# EAGLE design Schematic_DSP_2.0 (EAGLE 7.6.0)

## Sheet 1 of 2: Power
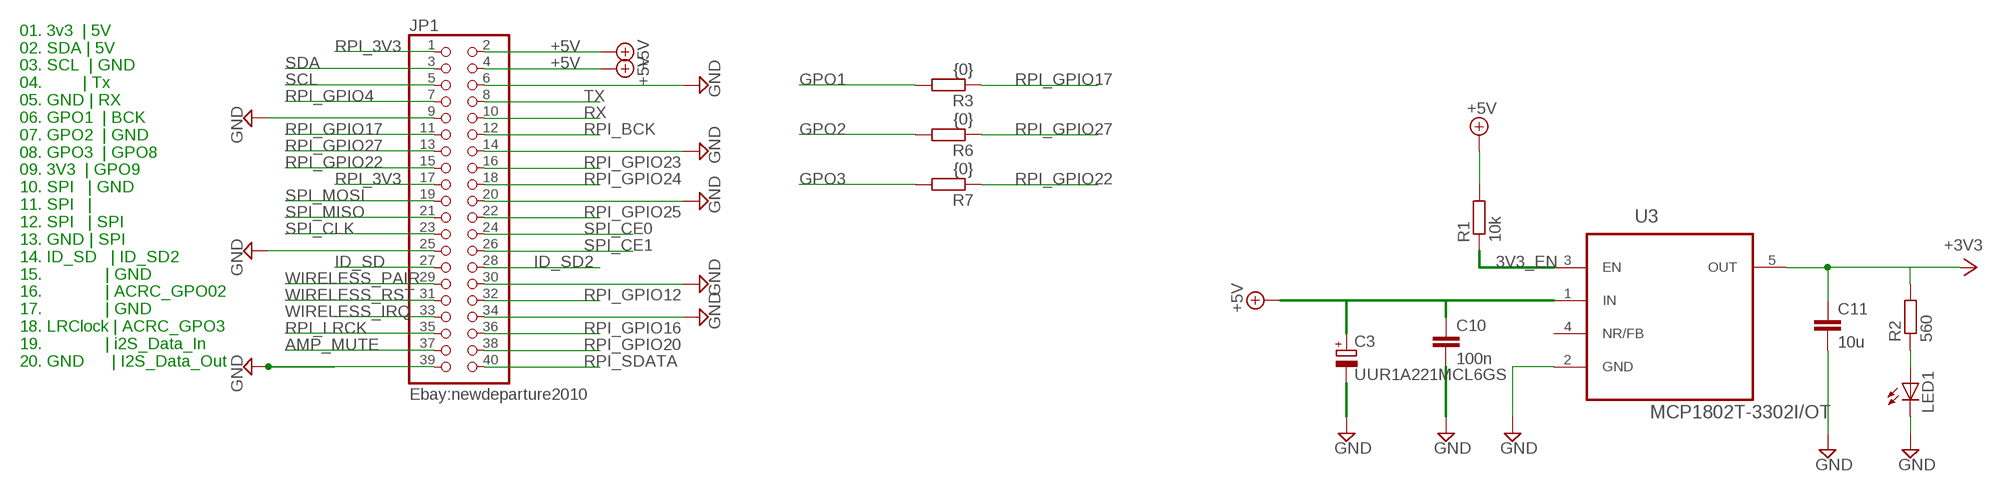
[diagram p0: schematic, sheet 1]

### Parts
C3  UUR1A221MCL6GS  CPOL-EUUD-6,3X7,7  [UD-6,3X7,7_NICHICON]
C10  100n  C-EUC0603  [C0603]
C11  10u  C-EUC0805  [C0805]
JP1  Ebay:newdeparture2010  PINHD-2X20  [2X20]
LED1  LEDSML0603  [SML0603]
R1  10k  R-EU_R0603  [R0603]
R2  560  R-EU_R0603  [R0603]
R3  {0}  R-EU_R0603  [R0603]
R6  {0}  R-EU_R0603  [R0603]
R7  {0}  R-EU_R0603  [R0603]
U3  MCP1802T-3302I/OT  TPS73633DBVT  [SOT95P280X145-5N]

### Nets
3V3_EN: R1.1 U3.3(EN)
+3V3 [+3V3]: C11.1 R2.2 U3.5(OUT) ; also sheet 2
+5V [+3V3]: C3.+ C10.1 JP1.2 JP1.4 R1.2 U3.1(IN) ; also sheet 2
AMP_MUTE: JP1.37 ; also sheet 2
GND [GND]: C3.- C10.2 C11.2 JP1.6 JP1.9 JP1.14 JP1.20 JP1.25 JP1.30 JP1.34 JP1.39 LED1.C U3.2(GND) ; also sheet 2
GPO1: R3.2 ; also sheet 2
GPO2: R6.2 ; also sheet 2
GPO3: R7.2 ; also sheet 2
ID_SD: JP1.27
ID_SD2: JP1.28
N$4: LED1.A R2.1
RPI_3V3: JP1.1 JP1.17
RPI_BCK: JP1.12 ; also sheet 2
RPI_GPIO4: JP1.7
RPI_GPIO12: JP1.32
RPI_GPIO16: JP1.36
RPI_GPIO17: JP1.11 R3.1
RPI_GPIO20: JP1.38
RPI_GPIO22: JP1.15 R7.1
RPI_GPIO23: JP1.16
RPI_GPIO24: JP1.18
RPI_GPIO25: JP1.22
RPI_GPIO27: JP1.13 R6.1
RPI_LRCK: JP1.35 ; also sheet 2
RPI_SDATA: JP1.40 ; also sheet 2
RX: JP1.10
SCL: JP1.5 ; also sheet 2
SDA: JP1.3 ; also sheet 2
SPI_CE0: JP1.24
SPI_CE1: JP1.26
SPI_CLK: JP1.23
SPI_MISO: JP1.21
SPI_MOSI: JP1.19
TX: JP1.8
WIRELESS_IRQ: JP1.33
WIRELESS_PAIR: JP1.29
WIRELESS_RST: JP1.31
Unconnected: U3.4(NR/FB)

### Notes on the sheet
- 01. 3v3  | 5V
  02. SDA | 5V
  03. SCL  | GND
  04.         | Tx
  05. GND | RX
  06. GPO1  | BCK
  07. GPO2  | GND
  08. GPO3  | GPO8
  09. 3V3  | GPO9
  10. SPI   | GND
  11. SPI   |
  12. SPI   | SPI
  13. GND | SPI
  14. ID_SD   | ID_SD2
  15.              | GND
  16.              | ACRC_GPO02
  17.              | GND
  18. LRClock | ACRC_GPO3
  19.              | i2S_Data_In
  20. GND      | I2S_Data_Out

## Sheet 2 of 2: Core
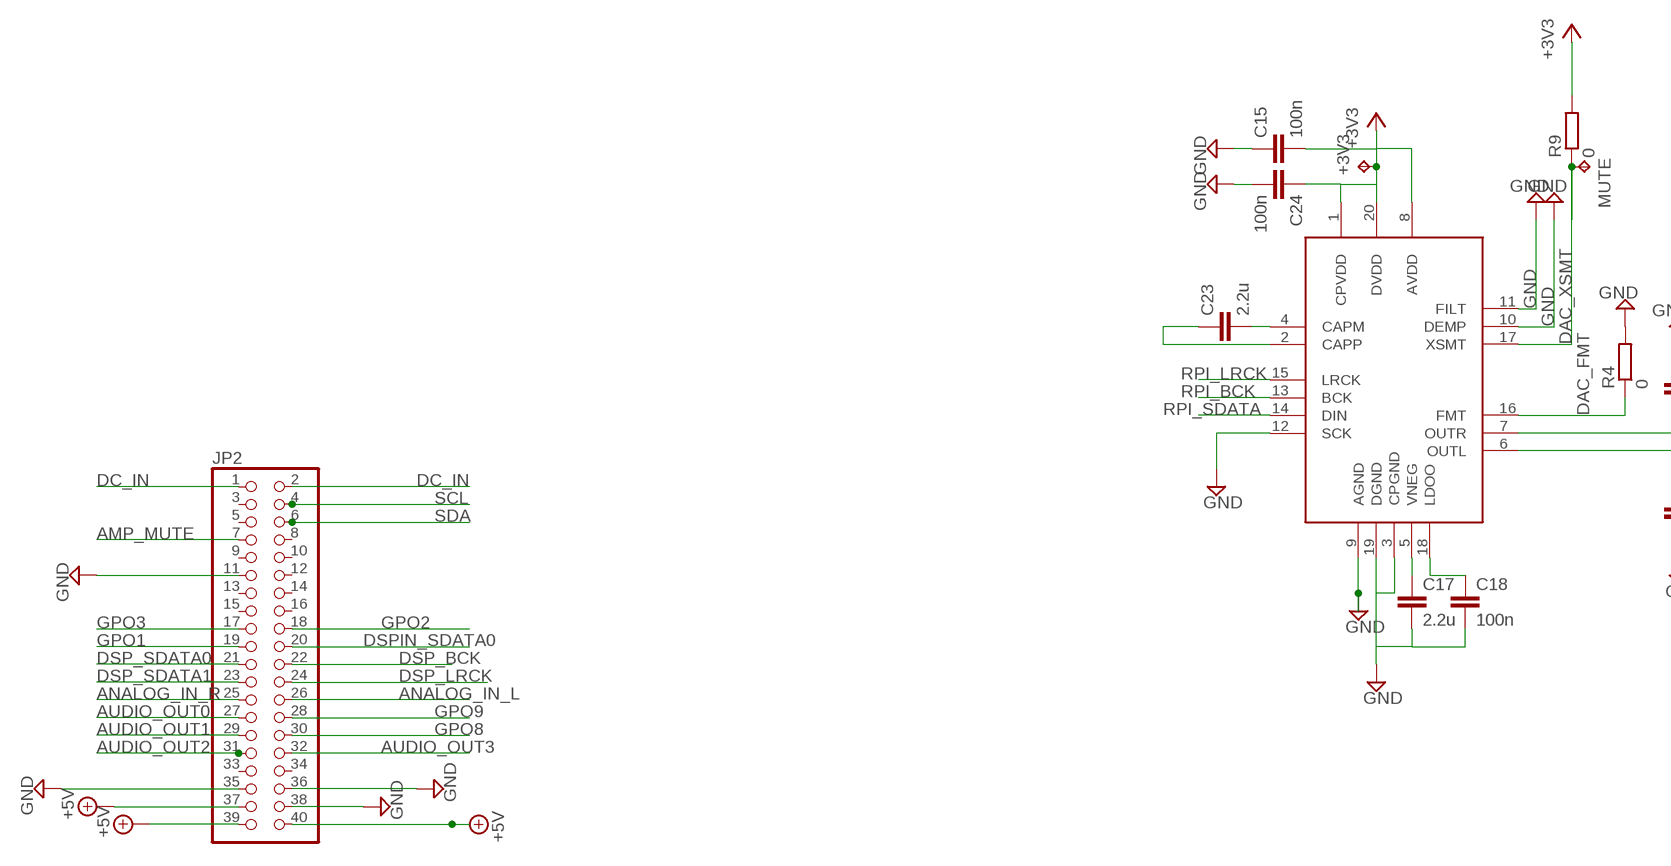
[diagram p1: schematic, sheet 2, part 1 of 2]
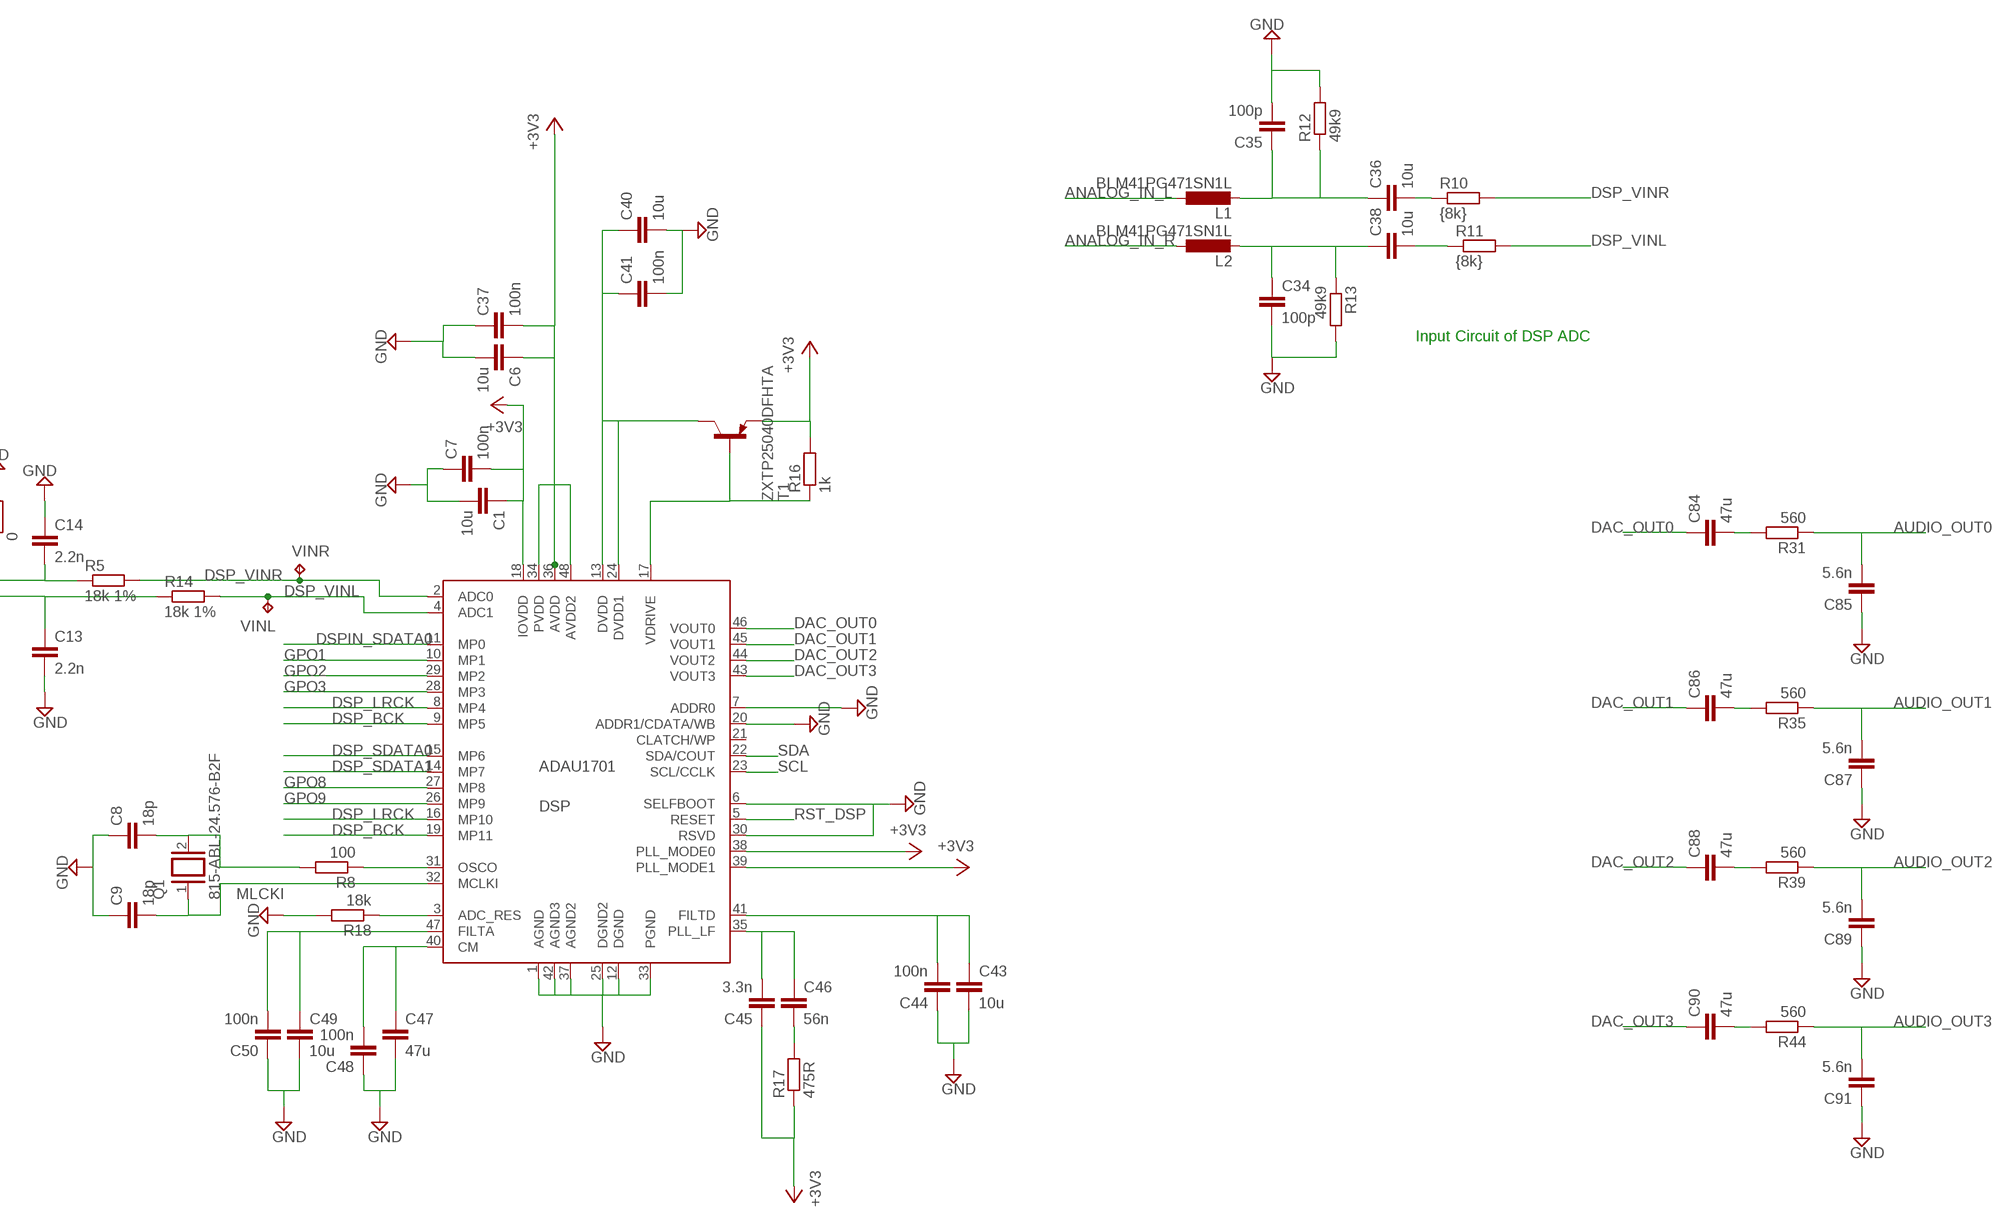
[diagram p2: schematic, sheet 2, part 2 of 2]

### Parts
+3V3  TPTP10R  [TP10R]
C1  10u  C-EUC0805  [C0805]
C6  10u  C-EUC0805  [C0805]
C7  100n  C-EUC0603  [C0603]
C8  18p  C-EUC0603  [C0603]
C9  18p  C-EUC0603  [C0603]
C13  2.2n  C-EUC0603  [C0603]
C14  2.2n  C-EUC0603  [C0603]
C15  100n  C-EUC0603  [C0603]
C17  2.2u  C-EUC0603  [C0603]
C18  100n  C-EUC0603  [C0603]
C23  2.2u  C-EUC0603  [C0603]
C24  100n  C-EUC0603  [C0603]
C34  100p  C-EUC0603  [C0603]
C35  100p  C-EUC0603  [C0603]
C36  10u  C-EUC0805  [C0805]
C37  100n  C-EUC0603  [C0603]
C38  10u  C-EUC0805  [C0805]
C40  10u  C-EUC0805  [C0805]
C41  100n  C-EUC0603  [C0603]
C43  10u  C-EUC0805  [C0805]
C44  100n  C-EUC0603  [C0603]
C45  3.3n  C-EUC0603  [C0603]
C46  56n  C-EUC0603  [C0603]
C47  47u  C-EUC0805  [C0805]
C48  100n  C-EUC0603  [C0603]
C49  10u  C-EUC0805  [C0805]
C50  100n  C-EUC0603  [C0603]
C84  47u  C-EUC0805  [C0805]
C85  5.6n  C-EUC0603  [C0603]
C86  47u  C-EUC0805  [C0805]
C87  5.6n  C-EUC0603  [C0603]
C88  47u  C-EUC0805  [C0805]
C89  5.6n  C-EUC0603  [C0603]
C90  47u  C-EUC0805  [C0805]
C91  5.6n  C-EUC0603  [C0603]
DAC1  PCM5102A  [20L-TSSOP]
DSP  ADAU1701  [PQFP48]
JP2  PINHD-2X20  [2X20]
L1  BLM41PG471SN1L  L-EUL4532C  [L4532M]
L2  BLM41PG471SN1L  L-EUL4532C  [L4532M]
MUTE  TPTP10R  [TP10R]
Q1  815-ABL-24.576-B2F  XTAL/S  [QS]
R4  0  R-EU_R0603  [R0603]
R5  18k 1%  R-EU_R0603  [R0603]
R8  100  R-EU_R0603  [R0603]
R9  0  R-EU_R0603  [R0603]
R10  {8k}  R-EU_R0603  [R0603]
R11  {8k}  R-EU_R0603  [R0603]
R12  49k9  R-EU_R0603  [R0603]
R13  49k9  R-EU_R0603  [R0603]
R14  18k 1%  R-EU_R0603  [R0603]
R16  1k  R-EU_R0603  [R0603]
R17  475R  R-EU_R0603  [R0603]
R18  18k  R-EU_R0603  [R0603]
R31  560  R-EU_R0603  [R0603]
R35  560  R-EU_R0603  [R0603]
R39  560  R-EU_R0603  [R0603]
R44  560  R-EU_R0603  [R0603]
T1  ZXTP25040DFHTA  BC857A-PNP-SOT23-BEC  [SOT23-BEC]
VINL  TPTP14R  [TP14R]
VINR  TPTP14R  [TP14R]

### Nets
+3V3 [+3V3]: +3V3.TP C1.1 C6.1 C7.2 C15.2 C24.1 C37.2 C45.1 DAC1.1(CPVDD) DAC1.8(AVDD) DAC1.20(DVDD) DSP.18(IOVDD) DSP.34(PVDD) DSP.36(AVDD) DSP.38(PLL_MODE0) DSP.39(PLL_MODE1) DSP.48(AVDD2) R9.2 R16.2 R17.1 T1.E ; also sheet 1
+5V [+3V3]: JP2.37 JP2.39 JP2.40 ; also sheet 1
AMP_MUTE: JP2.7 ; also sheet 1
ANALOG_IN_L: JP2.26 L1.1
ANALOG_IN_R: JP2.25 L2.1
AUDIO_OUT0: C85.2 JP2.27 R31.1
AUDIO_OUT1: C87.2 JP2.29 R35.1
AUDIO_OUT2: C89.2 JP2.31 R39.1
AUDIO_OUT3: C91.2 JP2.32 R44.1
CM: C47.1 C48.2 DSP.40(CM)
DAC_FMT: DAC1.16(FMT) R4.1
DAC_OUT0: C84.1 DSP.46(VOUT0)
DAC_OUT1: C86.1 DSP.45(VOUT1)
DAC_OUT2: C88.1 DSP.44(VOUT2)
DAC_OUT3: C90.1 DSP.43(VOUT3)
DAC_OUTL: C13.1 DAC1.6(OUTL) R14.1
DAC_OUTR: C14.2 DAC1.7(OUTR) R5.1
DAC_XSMT: DAC1.17(XSMT) MUTE.TP R9.1
DC_IN: JP2.1 JP2.2
DSP_BCK [Clock]: DSP.9(MP5) DSP.19(MP11) JP2.22
DSP_LRCK [Clock]: DSP.8(MP4) DSP.16(MP10) JP2.24
DSP_SDATA0 [Clock]: DSP.15(MP6) JP2.21
DSP_SDATA1 [Clock]: DSP.14(MP7) JP2.23
DSP_VINL: DSP.4(ADC1) R11.2 R14.2 VINL.TP
DSP_VINR: DSP.2(ADC0) R5.2 R10.2 VINR.TP
DSPIN_SDATA0: DSP.11(MP0) JP2.20
FILTA: C49.1 C50.2 DSP.47(FILTA)
FILTD [Clock]: C43.1 C44.2 DSP.41(FILTD)
GND [GND]: C1.2 C6.2 C7.1 C8.1 C9.1 C13.2 C14.1 C15.1 C17.2 C18.2 C24.2 C34.2 C35.2 C37.1 C40.2 C41.2 C43.2 C44.1 C47.2 C48.1 C49.2 C50.1 C85.1 C87.1 C89.1 C91.1 DAC1.3(CPGND) DAC1.9(AGND) DAC1.10(DEMP) DAC1.11(FILT) DAC1.12(SCK) DAC1.19(DGND) DSP.1(AGND) DSP.6(SELFBOOT) DSP.7(ADDR0) DSP.12(DGND) DSP.20(ADDR1/CDATA/WB) DSP.25(DGND2) DSP.30(RSVD) DSP.33(PGND) DSP.37(AGND2) DSP.42(AGND3) JP2.11 JP2.35 JP2.36 JP2.38 R4.2 R12.2 R13.2 R18.2 ; also sheet 1
GPO1: DSP.10(MP1) JP2.19 ; also sheet 1
GPO2: DSP.29(MP2) ; also sheet 1
GPO3: DSP.28(MP3) ; also sheet 1
GPO8: DSP.27(MP8) JP2.30
GPO9: DSP.26(MP9) JP2.28
MLCKI [Clock]: C9.2 DSP.32(MCLKI) Q1.1
N$5: C40.1 C41.1 DSP.13(DVDD) DSP.24(DVDD1) T1.C
N$7 [Clock]: DSP.31(OSCO) R8.1
N$8: DSP.17(VDRIVE) R16.1 T1.B
N$13 [Clock]: C8.2 Q1.2 R8.2
N$18: C46.2 R17.2
N$23: C17.1 DAC1.5(VNEG)
N$24: C23.2 DAC1.4(CAPM)
N$27: DSP.3(ADC_RES) R18.1
N$32: C36.2 R10.1
N$38: C18.1 DAC1.18(LDOO)
N$40: C38.2 R11.1
N$41: C23.1 DAC1.2(CAPP)
N$44: C34.1 C38.1 L2.2 R13.1
N$45: C35.1 C36.1 L1.2 R12.1
N$75: C84.2 R31.2
N$76: C86.2 R35.2
N$77: C88.2 R39.2
N$78: C90.2 R44.2
PLL_LF [Clock]: C45.2 C46.1 DSP.35(PLL_LF)
RPI_BCK: DAC1.13(BCK) ; also sheet 1
RPI_LRCK: DAC1.15(LRCK) ; also sheet 1
RPI_SDATA: DAC1.14(DIN) ; also sheet 1
RST_DSP: DSP.5(RESET)
SCL: DSP.23(SCL/CCLK) JP2.4 ; also sheet 1
SDA: DSP.22(SDA/COUT) JP2.6 ; also sheet 1
Unconnected: DSP.21(CLATCH/WP) JP2.3 JP2.5 JP2.8 JP2.9 JP2.10 JP2.12 JP2.13 JP2.14 JP2.15 JP2.16 JP2.17 JP2.18 JP2.33 JP2.34

### Notes on the sheet
- Input Circuit of DSP ADC

## Library data of the parts
+3V3 MUTE VINL VINR = testpad:TP: Test pad
C1 C6-C11 C13-C15 C17 C18 C23 C24 C34-C38 C40 C41 C43-C50 C84-C91 = rcl:C-EU: CAPACITOR, European symbol
C3 = rcl:CPOL-EU: POLARIZED CAPACITOR, European symbol
DAC1 = Texas Instruments_By_element14_Batch_1:PCM5102A: 2VRMS DirectPath™, 112/106/100dB Audio Stereo DAC with 32-bit, 384kHz PCM Interface
DSP = analog-devices:ADAU1701
JP1 JP2 = pinhead:PINHD-2X20: PIN HEADER
L1 L2 = rcl:L-EU: INDUCTOR, European symbol
LED1 = led:LED: LED OSRAM: - CHIPLED LG R971, LG N971, LY N971, LG Q971, LY Q971, LO R971, LY R971 LH N974, LH R974 LS Q976, LO Q976, LY Q976 LO Q996 - Hyper CHIPLED LW Q18S LB Q993, LB Q99A, LB R99A - SideLED LS A670, LO A670, LY A670, LG A670, LP A670 LB A673, LV A673, LT A673, LW A673 LH A674 LY A675 LS A676, LA A676, LO A676, LY A676, LW A676 LS A679, LY A679, LG A679 - Hyper Micro SIDELED® LS Y876, LA Y876, LO Y876, LY Y876 LT Y87S - SmartLED LW L88C, LW L88S LB L89C, LB L89S, LG L890 LS L89K, LO L89K, LY L89K LS L896, LA L896, LO L896, LY L896 - TOPLED LS T670, LO T670, LY T670, LG T670, LP T670 LSG T670, LSP T670, LSY T670, LOP T670, LYG T670 LG T671, LOG T671, LSG T671 LB T673, LV T673, LT T673, LW T673 LH T674 LS T676, LA T676, LO T676, LY T676, LB T676, LH T676, LSB T676, LW T676 LB T67C, LV T67C, LT T67C, LS T67K, LO T67K, LY T67K, LW E67C LS E67B, LA E67B, LO E67B, LY E67B, LB E67C, LV E67C, LT E67C LW T67C LS T679, LY T679, LG T679 LS T770, LO T770, LY T770, LG T770, LP T770 LB T773, LV T773, LT T773, LW T773 LH T774 LS E675, LA E675, LY E675, LS T675 LS T776, LA T776, LO T776, LY T776, LB T776 LHGB T686 LT T68C, LB T68C - Hyper Mini TOPLED® LB M676 - Mini TOPLED Santana® LG M470 LS M47K, LO M47K, LY M47K Source: http://www.osram.convergy.de LUXEON: - LUMILED® LXK2-PW12-R00, LXK2-PW12-S00, LXK2-PW14-U00, LXK2-PW14-V00 LXK2-PM12-R00, LXK2-PM12-S00, LXK2-PM14-U00 LXK2-PE12-Q00, LXK2-PE12-R00, LXK2-PE12-S00, LXK2-PE14-T00, LXK2-PE14-U00 LXK2-PB12-K00, LXK2-PB12-L00, LXK2-PB12-M00, LXK2-PB14-N00, LXK2-PB14-P00, LXK2-PB14-Q00 LXK2-PR12-L00, LXK2-PR12-M00, LXK2-PR14-Q00, LXK2-PR14-R00 LXK2-PD12-Q00, LXK2-PD12-R00, LXK2-PD12-S00 LXK2-PH12-R00, LXK2-PH12-S00 LXK2-PL12-P00, LXK2-PL12-Q00, LXK2-PL12-R00 Source: www.luxeon.com KINGBRIGHT: KA-3528ASYC Source: www.kingbright.com
Q1 = special:XTAL/S: CRYSTAL
R1-R14 R16-R18 R31 R35 R39 R44 = rcl:R-EU_: RESISTOR, European symbol
T1 = transistor:*-PNP-: PNP Transistror
U3 = Texas Instruments_By_element14_Batch_1:TPS73633DBVT: Cap-Free, NMOS, 400mA Low-Dropout Regulator with Reverse Current Protection; MPN: TPS73633DBVT; OC_FARNELL: 1535775; OC_NEWARK: 87H2981; PACKAGE: SOT-23-5; SUPPLIER: Texas Instruments

## Net classes
0 default: width 0.152 mm, clearance 0.152 mm
1 Clock: width 0.152 mm, clearance 0.152 mm
2 +3V3: width 0.152 mm, clearance 0.152 mm
3 GND: width 0.152 mm, clearance 0.152 mm

## Board
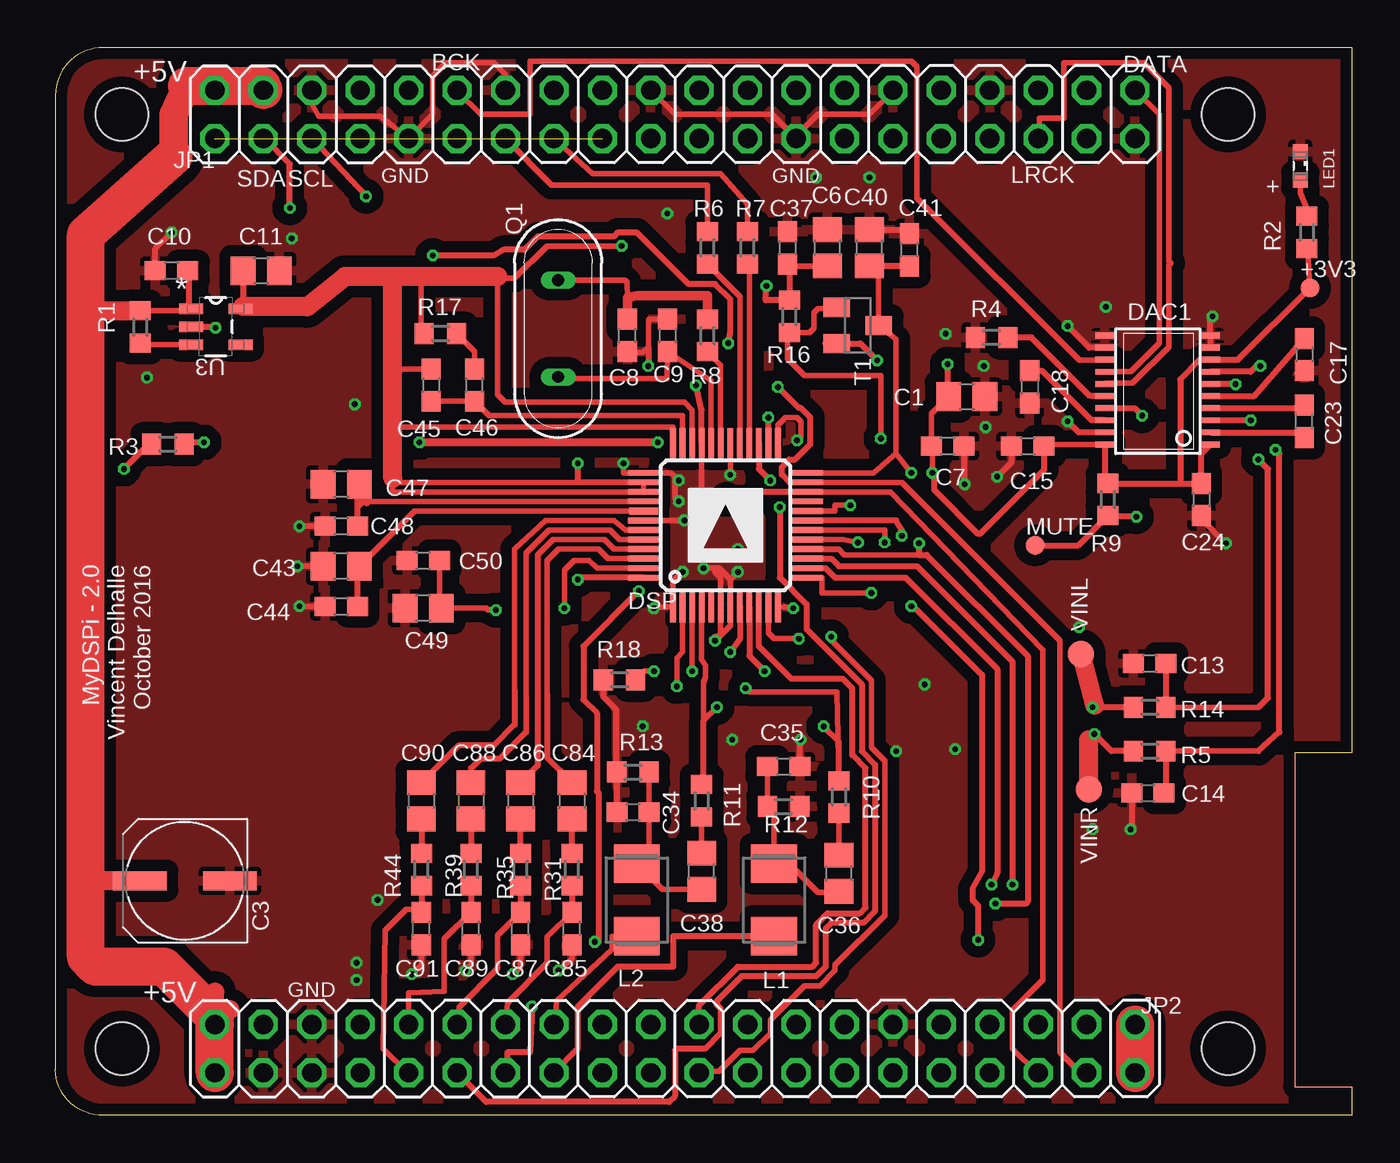
[diagram p3: board, top side]
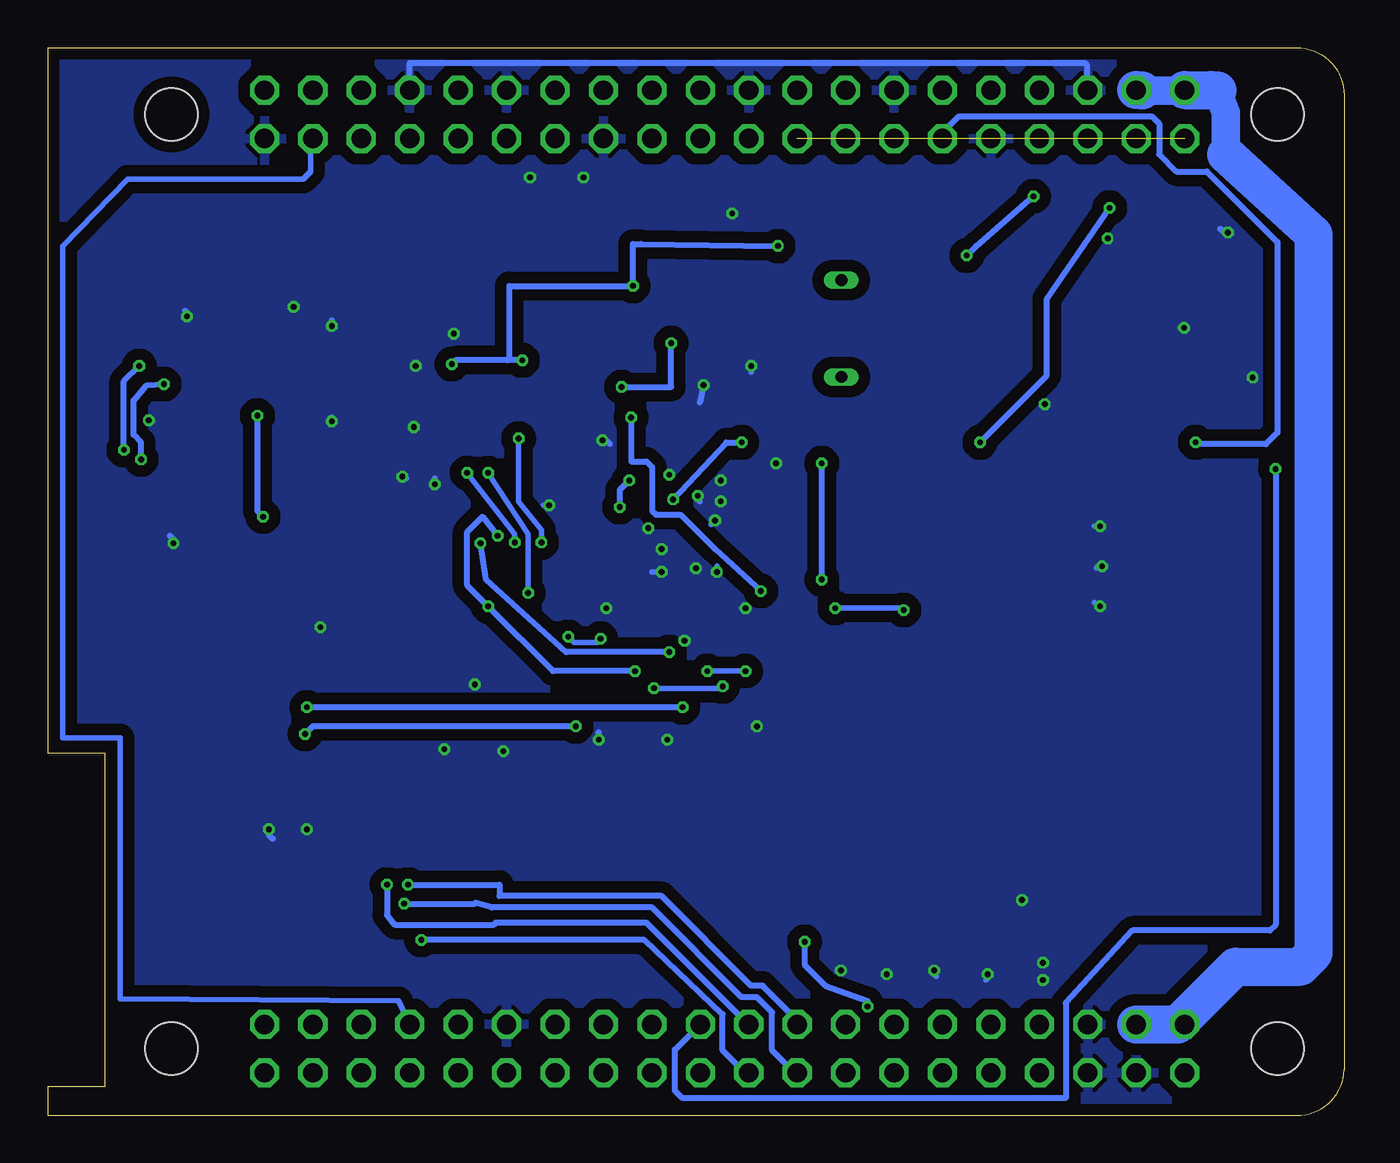
[diagram p4: board, bottom side, seen from below]

Size 68 x 56 mm. Coordinates in mm from the lower left corner, seen from the top.
Outline: 0,53.5 0,2.4 arc90 2.5,0 68,0 68,1.5 65,1.5 65,19 68,19 68,56 2.5,56 arc90 0,53.5
Copper layers (1*16): Top 0.035mm / dielectric 1.6mm / Bottom 0.035mm
Design rules "Elecrow_2-layer_PCB_eagle_rule": minimum track width 6mil, minimum drill 12mil, track to track 6mil, track to pad 8mil, pad to pad 12mil, via to via 12mil, smd to smd 0mil, copper to edge 20mil, drill to drill 10mil, minimum pad ring 6mil, minimum via ring 6mil, stop-mask expansion 0mil, vias tented up to drill 100mil, thermal gap 10mil
Holes 2.75 mm at 3.5,3.5 3.5,52.5 61.5,52.5 61.5,3.5

### Footprints (pad centres in the part's own frame; a part is rotated, then mirrored left to right if it is on the bottom)
TP10R = smd 1 x 1: TP 0,0
C0805 = smd 1.3 x 1.5: 1 -0.95,0; 2 0.95,0
UD-6,3X7,7_NICHICON = smd 2.8 x 1: + 2.35,0; - -2.35,0
C0603 = smd 1.1 x 1: 1 -0.85,0; 2 0.85,0
20L-TSSOP = smd 0.305 x 0.991: 1 -3.112,-2.378; 2 -2.478,-2.378; 3 -1.843,-2.378; 4 -1.208,-2.378; 5 -0.573,-2.378; 6 0.062,-2.378; 7 0.698,-2.378; 8 1.333,-2.378; 9 1.968,-2.378; 10 2.603,-2.378; 11 2.603,3.158; 12 1.968,3.158; 13 1.333,3.158; 14 0.698,3.158; 15 0.062,3.158; 16 -0.573,3.158; 17 -1.208,3.158; 18 -1.843,3.158; 19 -2.478,3.158; 20 -3.112,3.158
PQFP48 = smd 1.6 x 0.3: 1 -4.3,2.75; 2 -4.3,2.25; 3 -4.3,1.75; 4 -4.3,1.25; 5 -4.3,0.75; 6 -4.3,0.25; 7 -4.3,-0.25; 8 -4.3,-0.75; 9 -4.3,-1.25; 10 -4.3,-1.75; 11 -4.3,-2.25; 12 -4.3,-2.75; 25 4.3,-2.75; 26 4.3,-2.25; 27 4.3,-1.75; 28 4.3,-1.25; 29 4.3,-0.75; 30 4.3,-0.25; 31 4.3,0.25; 32 4.3,0.75; 33 4.3,1.25; 34 4.3,1.75; 35 4.3,2.25; 36 4.3,2.75 | smd 0.3 x 1.6: 13 -2.75,-4.3; 14 -2.25,-4.3; 15 -1.75,-4.3; 16 -1.25,-4.3; 17 -0.75,-4.3; 18 -0.25,-4.3; 19 0.25,-4.3; 20 0.75,-4.3; 21 1.25,-4.3; 22 1.75,-4.3; 23 2.25,-4.3; 24 2.75,-4.3; 37 2.75,4.3; 38 2.25,4.3; 39 1.75,4.3; 40 1.25,4.3; 42 0.25,4.3; 43 -0.25,4.3; 44 -0.75,4.3; 45 -1.25,4.3; 46 -1.75,4.3; 47 -2.25,4.3; 48 -2.75,4.3 | smd 0.35 x 1.5: 41 0.75,4.3
2X20 = drill 1.016 octagon: 1 -24.13,-1.27; 2 -24.13,1.27; 3 -21.59,-1.27; 4 -21.59,1.27; 5 -19.05,-1.27; 6 -19.05,1.27; 7 -16.51,-1.27; 8 -16.51,1.27; 9 -13.97,-1.27; 10 -13.97,1.27; 11 -11.43,-1.27; 12 -11.43,1.27; 13 -8.89,-1.27; 14 -8.89,1.27; 15 -6.35,-1.27; 16 -6.35,1.27; 17 -3.81,-1.27; 18 -3.81,1.27; 19 -1.27,-1.27; 20 -1.27,1.27; 21 1.27,-1.27; 22 1.27,1.27; 23 3.81,-1.27; 24 3.81,1.27; 25 6.35,-1.27; 26 6.35,1.27; 27 8.89,-1.27; 28 8.89,1.27; 29 11.43,-1.27; 30 11.43,1.27; 31 13.97,-1.27; 32 13.97,1.27; 33 16.51,-1.27; 34 16.51,1.27; 35 19.05,-1.27; 36 19.05,1.27; 37 21.59,-1.27; 38 21.59,1.27; 39 24.13,-1.27; 40 24.13,1.27
L4532M = smd 2 x 2.4: 1 -1.9,0; 2 1.9,0
SML0603 = smd 0.8 x 0.8: A 0.75,0; C -0.75,0
QS = drill 0.61 long: 1 -2.54,0; 2 2.54,0
R0603 = smd 1 x 1.1: 1 -0.85,0; 2 0.85,0
SOT23-BEC = smd 1 x 1.4: B -0.95,-1.1; C 0,1.1; E 0.95,-1.1
SOT95P280X145-5N = smd 1.27 x 0.559: 1 -1.295,0.94; 2 -1.295,0; 3 -1.295,-0.94; 4 1.295,-0.94; 5 1.295,0.94
TP14R = smd 1.4 x 1.4: TP 0,0

### Placement (x,y rotation side)
+3V3  65.8,43.4 0 top
C1  47.8,37.7 0 top
C3  6.8,12.3 180 top
C6  40.5,45.5 90 top
C7  46.8,35.1 180 top
C8  30,40.9 90 top
C9  32.1,40.9 270 top
C10  6.1,44.3 180 top
C11  10.8,44.3 0 top
C13  57.4,23.7 180 top
C14  57.3,16.9 0 top
C15  51,35.1 0 top
C17  65.5,39.9 270 top
C18  51.1,38.2 270 top
C23  65.5,36.4 90 top
C24  60.1,32.3 270 top
C34  30.3,15.9 180 top
C35  38.2,18.3 0 top
C36  41.1,12.7 90 top
C37  38.4,45.5 270 top
C38  33.9,12.8 90 top
C40  42.7,45.5 90 top
C41  44.8,45.4 90 top
C43  15,28.8 180 top
C44  15,26.7 0 top
C45  19.7,38.3 270 top
C46  22,38.3 90 top
C47  15,33.1 180 top
C48  15,30.9 0 top
C49  19.3,26.6 180 top
C50  19.3,29.1 0 top
C84  27.1,16.5 270 top
C85  27.1,9.8 90 top
C86  24.4,16.5 270 top
C87  24.4,9.8 90 top
C88  21.8,16.5 270 top
C89  21.8,9.8 90 top
C90  19.2,16.5 270 top
C91  19.2,9.8 90 top
DAC1  58.2,38.3 90 top
DSP  35.15,30.95 90 top
JP1  32.5,52.5 0 top
JP2  32.5,3.5 180 top
L1  37.7,11.3 90 top
L2  30.5,11.3 90 top
LED1  65.3,49.8 270 top
MUTE  51.4,29.9 0 top
Q1  26.37,41.27 90 top
R1  4.46,41.35 90 top
R2  65.64,46.31 270 top
R3  5.9,35.2 180 top
R4  49.1,40.8 180 top
R5  57.4,19.1 180 top
R6  34.2,45.5 270 top
R7  36.3,45.5 270 top
R8  34.2,40.9 90 top
R9  55.2,32.3 90 top
R10  41.1,16.7 90 top
R11  33.9,16.5 90 top
R12  38.2,16.2 0 top
R13  30.3,18 180 top
R14  57.4,21.4 180 top
R16  38.5,41.9 90 top
R17  20.2,41 0 top
R18  29.59,22.84 180 top
R31  27.1,12.9 90 top
R35  24.4,12.9 90 top
R39  21.8,12.9 90 top
R44  19.2,12.9 90 top
T1  42.08,41.43 270 top
U3  8.42,41.36 0 top
VINL  53.8,24.2 0 top
VINR  54.2,17.1 0 top

### Tracks (layer width: path | path; a pad name or v marks a point on that pad's centre or on a via)
3V3_EN
  Top 0.3: U3.3 4.54,40.42 R1.1
+3V3  (via drill 0.3)
  Top 0.3: C6.1 38.5,44.55 C37.2 | C1.1 45.95,36.8 C7.2 46,35.05 v46,33.7 | DAC1.20 51.94,35.19 C15.2 | DSP.18 43.5,30.7 v43.5,30.05 | 23.1,44.1 23.2,44 23.3,43.9 | DSP.38 DSP.39 17.7,32.7 17.7,33.2 | 17.7,33.2 17.7,33.4 | 27.4,33.2 17.7,33.2 | DSP.36 32.4,36.1 17.7,36.1 17.7,35.8 | R17.1 19.18,41 19.18,43.92 | C45.1 17.7,39.15 17.7,39 | v29.7,45.6 25.8,45.6 24.1,43.9 23.3,43.9 | DSP.34 33.4,37 33,37.4 23.6,37.4 23.2,37.8 23.2,43.8 23.3,43.9 | 19.5,43.98 19.5,43.94 | +3V3.TP 65.7,45.4 R2.2 | 13.17,42.43 13.2,42.4
  Top 0.31: C11.1 9.85,42.43 U3.5 | DSP.36 32.4,35.8 | 21.9,43.99 21.6,43.7 21.6,44 | DSP.38 27.4,33.2 v27.4,34.2 | 18.3,43.89 19.18,43.92 19.5,43.94 20.5,43.98 21.68,43.98 21.7,44 | 17.7,43.97 19.5,43.98 | DSP.48 27.5,28.2 v27.4,28.1 | 38.5,44.55 R16.2 37.25,42.75 v37.3,43.5 | 40.38,40.48 T1.E 42.22,40.48 v43.1,39.6 | v46.8,39.4 46.8,37.75 C1.1 | C15.2 51.85,33.85 48.5,30.5 48.4,30.5 46.1,32.8 46.1,33.6 v46,33.7 | +3V3.TP 62.03,39.63 DAC1.8 60.03,39.63 59,38.6 59,33.15 | DAC1.1 60.1,34.71 C24.1 59,33.15 | DAC1.20 55.04,33.31 R9.2 59,33.15
  Top 1: 17.7,33.4 17.7,35.8 17.7,39 17.7,43.97 | 23.2,44 21.7,44 21.6,44 15.2,44 13.2,42.4 | 9.85,42.43 13.17,42.43
  Bottom 0.3: v43.5,30.05 43.5,30.5 v46,33.7
  Bottom 0.31: v27.4,28.1 v27.4,34.2 | v29.7,45.6 36.9,45.7 37.3,45.7 v37.3,43.5 43.8,43.5 43.8,39.7 43.9,39.6 | v43.1,39.6 43.9,39.6 | 43.9,39.6 46.6,39.6 v46.8,39.4
+5V
  Top 0.3: R1.2 7.03,42.2 U3.1
  Top 0.31: 7.03,42.2 7.03,44.23 C10.1
  Top 0.406: 1.6,12.3 1.6,12.2
  Top 1: 8.37,5.13 8.37,6.47 | 6.2,50.3 1.5,45.36 1.9,42.5 2.2,42.2 R1.2 | 9.15,5.55 JP2.39 | C3.+ 1.6,12.3
  Top 1.5: 6.2,50.3 6.2,52.5 6.9,54
  Top 2: JP2.40 JP2.39 8.37,5.13 5.7,7.8 2.1,7.8 1.6,8.3 1.6,12.2 1.6,46.2 6.2,50.3 | 6.9,54 10.84,54 JP1.4
  Bottom 1.5: 6.2,50.4 6.2,52.6 6.65,53.75 10.59,53.75
  Bottom 2: JP2.37 8.73,4.77 5.7,7.8 2.3,7.8 1.6,8.5 1.6,46.2 6.2,50.4 | 10.59,53.75 JP1.4 | JP1.2 6.97,53.77 6.65,53.75
AMP_MUTE
  Bottom 0.3: JP2.7 49.6,6 64.2,6.1 64.2,19.8 67.2,19.8 67.2,45.6 63.8,49.1 54.6,49.1 54.2,49.5 54.2,51.12 JP1.37
ANALOG_IN_L
  Top 0.31: L1.1 32.4,9.4 32.4,7.8 29.5,7.8 27.4,5.7 27.4,3.48 JP2.26
ANALOG_IN_R
  Top 0.3: L2.1 29.2,9.4 29.2,8.7 26.3,6 26.2,4.8 JP2.25
AUDIO_OUT0
  Top 0.3: JP2.27 23.71,5.91 25.8,8 25.8,9.35 C85.2
  Top 0.31: R31.1 C85.2
AUDIO_OUT1
  Top 0.3: JP2.29 21.17,5.67 23.2,7.7 23.2,9.45 C87.2
  Top 0.31: R35.1 C87.2
AUDIO_OUT2
  Top 0.3: JP2.31 18.53,6.43 20.4,6.5 20.4,9.25 C89.2
  Top 0.31: R39.1 C89.2
AUDIO_OUT3
  Top 0.3: JP2.32 18.47,2.23 17.2,3.5 17.3,9.7 18.4,10.8 19.05,10.8 C91.2
  Top 0.31: R44.1 C91.2
CM
  Top 0.3: 16.35,32.1 15.85,32.6 | DSP.40 16.15,32.2 15.85,31.9
  Top 0.31: C48.2 15.85,31.9 15.85,32.6 15.85,33 C47.1
DAC_FMT
  Top 0.31: DAC1.16 54.27,37.73 51.2,40.8 R4.1
DAC_OUT0
  Top 0.3: DSP.46 29,29.2 28.5,29.7 26.4,29.7 25.8,29.1 25.8,22.1
  Top 0.31: 25.8,22.1 25.8,18.75 C84.1
DAC_OUT1
  Top 0.3: DSP.45 29.3,29.7 28.8,30.2 26.1,30.2 25.3,29.4
  Top 0.31: 25.3,29.4 25.3,18.35 C86.1
DAC_OUT2
  Top 0.3: DSP.44 29.6,30.2 29.1,30.7 25.9,30.7 24.7,29.5 24.7,21.9
  Top 0.31: 24.7,21.9 24.7,20.1 23.3,18.7 22.3,18.7 21.8,18.2 C88.1
DAC_OUT3
  Top 0.3: DSP.43 29.9,30.7 29.3,31.2 25.7,31.2 24.1,29.7 24.1,22.3
  Top 0.31: 24.1,22.3 24.1,20.5 23,19.4 21.15,19.4 C90.1
DAC_OUTL  (via drill 0.3)
  Top 0.3: R14.1 63.1,21.4 63.2,21.5
  Top 0.31: C13.1 R14.1 | 63.2,21.5 63.6,21.9 63.6,33.9 v63.1,34.4 | v61.9,38.35 60.54,38.35 DAC1.6
  Bottom 0.31: v63.1,34.4 63.1,35.3 63.5,35.7 63.5,37.5 62.8,38.3 v61.9,38.35
DAC_OUTR  (via drill 0.3)
  Top 0.3: R5.1 63.1,19.1
  Top 0.31: R5.1 58.25,17 C14.2 | 63.1,19.1 64.2,20.1 64.2,34.7 v64,34.9 | v63.2,39.3 63,39.3 62.7,39 DAC1.7
  Bottom 0.31: v64,34.9 64,38.5 v63.2,39.3
DAC_XSMT  (via drill 0.3)
  Top 0.31: MUTE.TP 53.65,29.9 R9.1 55.25,31.4 v56.7,31.4 | DAC1.17 56.61,37.09 v57,36.7
  Bottom 0.31: v57,36.7 57,31.7 v56.7,31.4
DC_IN
  Top 2: JP2.1 JP2.2
DSP_BCK  (via drill 0.3)
  Top 0.31: DSP.9 36.4,24.1 v37.2,23.3 | v44.4,30.4 44.4,30.7 44.1,31.2 DSP.19 | v44.9,26.7 45,26.7 48.6,23.1 48.6,12.8 48.1,11.9 48.1,11.3 48.4,11 v48.4,9.2
  Bottom 0.31: JP2.22 31.27,2.23 | 31.27,2.23 31.4,2.1 | 31.27,2.23 31.43,2.23 32.6,3.4 32.6,5.3 36.7,9.2 v48.4,9.2 | v44.4,30.4 45.2,31.4 46,30.6 46,27.8 v44.9,26.7 41.5,23.3 v37.2,23.3
DSP_LRCK  (via drill 0.3)
  Top 0.3: 41.4,29.4 45.3,29.4
  Top 0.31: DSP.16 41.1,29.7 41.4,29.4 | v49.3,11.1 50.9,11.1 51,11.2 51,24.1 45.7,29.4 45.3,29.4 v45.3,30 | DSP.8 35.9,25 v35.4,24.3
  Bottom 0.31: JP2.24 28.83,2.23 30,3.4 30,5.4 30.8,6.2 31.6,6.2 36.3,10.9 44.7,10.9 45.55,11.15 45.6,11.1 v49.3,11.1 | v35.4,24.3 40.8,24.3 45,28.1 v45.3,30
DSP_SDATA0  (via drill 0.3)
  Top 0.31: DSP.15 40.7,29.2 41.1,28.8 45.2,28.8 50.2,23.8 v50.2,12.1
  Bottom 0.31: JP2.21 31.27,4.77 36.6,10.1 44.5,10.1 44.6,10 49.8,10 50.2,10.5 v50.2,12.1
DSP_SDATA1  (via drill 0.3)
  Top 0.31: DSP.14 40.4,28.7 40.9,28.2 44.6,28.2 49.4,23.4 49.4,12.7 v49.1,12.1
  Bottom 0.31: JP2.23 28.69,4.99 30.5,6.8 31.1,6.8 35.8,11.5 44.3,11.5 44.3,12.1 v49.1,12.1
DSP_VINL  (via drill 0.3)
  Top 0.3: DSP.4 33.9,23.9 34.1,23.6 34.1,23 34,22.7 34,17.45 R11.2 | 54.5,21.5 v54.4,21.4
  Top 0.31: 34,17.45 34,20.7 v34.7,21.4 | 54.45,21.4 v54.4,21.4 R14.2
  Top 1: VINL.TP 54.5,21.5
  Bottom 0.31: v34.7,21.4 v54.4,21.4
DSP_VINR  (via drill 0.3)
  Top 0.3: R10.2 41,22.2 36.4,22.2 v36.2,22.4 | v32.6,22.5 32.6,24 32.9,24.3 DSP.2 | 54.2,19.7 v54.5,20
  Top 0.31: R10.2 41.1,19.6 v40.3,20.4 | R5.2 55.4,19.1 v54.5,20
  Top 1: VINR.TP 54.2,19.7
  Bottom 0.3: v36.2,22.4 32.7,22.4 v32.6,22.5
  Bottom 0.31: v40.3,20.4 54.1,20.4 v54.5,20
DSPIN_SDATA0  (via drill 0.3)
  Top 0.3: v39,25 37.7,25 37.4,25.3 DSP.11 | v40.7,25.1 40.7,24.9 42.8,22.8 42.8,19.3 43.5,18.6 43.5,10.5 40.9,7.9 40.9,7.6 40.1,6.8 39.3,6.8 37.5,5 37.5,4.3 36.6,3.4 35.9,3.4 34.8,2.3 33.8,2.3 JP2.20
  Bottom 0.3: v39,25 39.2,24.8 40.4,24.8 v40.7,25.1
FILTA  (via drill 0.3)
  Top 0.3: DSP.47 28.4,28.7 28,29.1 27.2,29.1 26.7,28.6 v26.7,26.6 | v23.1,26.5 22.7,26.5 22.6,26.6 C49.1 20.15,26.7 C50.2
  Bottom 0.3: v26.7,26.6 23.2,26.6 v23.1,26.5
FILTD
  Top 0.3: DSP.41 18.85,31.7 C43.1
  Top 0.31: C44.2 15.85,28.7 C43.1
GND  (via drill 0.3)
  Top 0.3: C91.1 19.2,7.9 v18.7,7.4 | C87.1 24.4,7.8 v24,7.4 | C89.1 21.8,7.9 v21.5,7.6 | v29.8,34.2 29.8,33.7 DSP.37 32.3,33.7 32.5,33.5 32.5,32.4 v32.7,32.2 | DSP.42 v33,31.2 | v32.9,28.5 32.4,28 DSP.1 31.95,26.65 v31.4,26.6 | DSP.12 38.65,26.65 v38.7,26.6 | 35.4,28.1 DSP.7 35.4,25.7 34.8,25.1 34.9,25.3 DSP.6 34.9,28.2 34.6,28.5 | 35.4,28.1 v35.8,28.5 | 35.4,28.1 34.8,28.7 v34,28.7 | DSP.33 v33.9,32.5 | DSP.30 v35.4,33.6 | DSP.25 37.9,36.2 38.3,36.6 38.9,36.6 39.1,36.4 39.1,35.6 v38.9,35.4 | C48.1 v12.8,30.9 | C43.2 v12.7,28.8 | C44.1 v12.8,26.7 | JP1.6 13.45,53.05 13.8,52.4 17.06,52.4 JP1.9 19.8,52.5 19.8,54.5 20.5,55.2 23,55.2 23.61,54.59 JP1.14 | DSP.20 40.9,31.7 40.9,32 v41.7,32 | JP1.20 32.5,52.5 37.6,52.5 38.8,51.3 JP1.25 38.9,51.4 40,52.5 42.7,52.5 43.9,53.7 JP1.30 | C9.1 31.15,41.75 31.1,41.7 31.1,40.3 30.8,40 30.05,40 C8.1 | C85.1 27.1,8.2 v26.4,7.6
  Top 0.31: DSP.33 33.9,37 v33.6,38.3 | 19.1,8.85 C91.1 | U3.2 8.34,41.36 v8.4,41.3 | C7.1 47.65,33.15 v47.7,33.1 | 34.8,25.1 34.6,25.1 v34.6,24.9 | C35.2 39.05,19.65 v39.1,19.7 | C40.2 44.6,46.45 C41.2 | 31.1,40.3 v31.1,39.3 | C34.2 R13.2 29.4,18.05 29.4,21.3 28.74,21.96 R18.2 | C15.1 50.15,34.25 v49.4,33.5 | DAC1.19 53.68,35.82 v53.1,36.4 | DAC1.12 54.23,40.27 v53.1,41.4 | v60.7,41.9 60.58,41.78 DAC1.10 DAC1.9 | DAC1.3 62.64,36.46 v62.7,36.45 | C14.1 56.45,15.05 v56.4,15 | C24.2 60.1,31.3 v61.4,30 | 4.75,38.65 v4.8,38.7 | C10.2 5.25,45.45 v6.1,46.3
  Bottom 0.3: v18.7,7.4 18.7,7.2 18.8,7.1 | v24,7.4 23.9,7.3 | v21.5,7.6 21.5,7.4 21.4,7.3 | v29.8,34.2 29.7,34.1 | v33,31.2 33.2,31 | v32.9,28.5 32.9,28.8 | v38.7,26.6 38.8,26.7 | v35.8,28.5 36.3,28.5 | v34,28.7 33.9,28.7 | v33.9,32.5 33.9,32.3 33.8,32.2 | v35.4,33.6 35.5,33.5 | v38.9,35.4 38.7,35.4 38.5,35.2 | v12.8,30.9 13.1,30.9 | v12.7,28.8 13,28.7 12.9,28.8 | v12.8,26.7 13.1,26.9 | v32.7,32.2 32.7,32.1 | 41.5,32 v41.7,32 42,32 | 26.6,7.6 v26.4,7.6 26.2,7.6 | v31.4,26.6 31.6,26.6
  Bottom 0.31: v33.6,38.3 33.8,37.4 | v8.4,41.3 8.6,41.3 | v47.7,33.1 47.7,33.4 | v34.6,24.9 34.6,24.8 | v39.1,19.7 39.1,20.1 | v31.1,39.3 31.1,39 | v49.4,33.5 49.3,33.5 49.2,33.4 | v53.1,36.4 53.1,36.6 | v53.1,41.4 53.1,41.7 | v60.7,41.9 60.7,42.1 60.8,42.2 | v62.7,36.45 62.5,36.4 | v56.4,15 56.4,14.7 56.2,14.5 | v61.4,30 61.4,30.2 61.6,30.4 | v4.8,38.7 4.8,38.9 | v6.1,46.3 6.3,46.3 6.5,46.5 | JP1.34 49.01,55.19 49,55.2 13.6,55.2 13.5,55.1 13.5,53.82 JP1.6
  other vias: 30.8,20.4 35.5,19.7 44.1,19.1 47.2,19.2 45.6,22.6 54.4,15 53.7,25.6 55.1,42.4 42.7,49.2 39.9,49.2 32.1,47.3 12.4,46 15.8,7.1 15.8,8 16.9,11.3 15.7,37.3 35.8,29.7 36.5,30.8 32.7,33.3 46.7,41 48.7,39.3 48.8,36.1
  pour Bottom (isolate 0.6): 1.7,55.4 arc90 0.1,52.9 0.5,2.9 arc90 3,0.4 64.5,0.4 arc90 67.6,0.3 67.6,56.4
  pour Top (isolate 0.6): 2.2,55.6 arc90 0.4,51.2 0.4,2.8 arc90 2.8,0.2 65.7,0.3 arc90 64.9,1.2 64.7,1.2 64.7,19.6 67.4,19.6 67.4,19.4 67.7,55.5
GPO1  (via drill 0.3)
  Top 0.31: JP2.19 33.77,5.77 35.8,7.8 39.7,7.8 39.9,8 39.9,10 40.5,10.6 42.2,10.6 42.5,10.9 42.5,18.2 41.8,18.9 41.8,22.4 41.3,22.9 38.6,22.9 36.9,24.6 DSP.10 | R3.2 4.9,35.2 v3.6,33.9
  Bottom 0.31: v3.6,33.9 3.6,10 3.9,9.7 11.1,9.7 14.6,5.9 14.6,0.9 34.7,0.9 35.1,1.3 35.1,3.44 JP2.19
GPO2
  Top 0.3: DSP.29 35.9,42.95 R6.2
GPO3
  Top 0.3: DSP.28 36.4,44.55 R7.2
GPO8  (via drill 0.3)
  Top 0.31: JP2.30 22.6,0.7 32.2,0.7 32.5,1 32.5,3.4 32.6,3.5 34.1,3.5 34.9,4.3 34.9,5.6 34.7,5.8 34.7,6 36,7.3 39.9,7.3 40.4,7.8 40.4,9.8 40.7,10.1 42.4,10.1 43,10.7 43,18.4 42.3,19.1 42.3,22.6 39.4,25.5 39.4,26.8 38,28.2 v38,31.9 | v37.5,33.3 36.9,33.9 DSP.27
  Bottom 0.31: v38,31.9 38,32.8 v37.5,33.3
GPO9  (via drill 0.3)
  Top 0.31: 25.1,5.8 v25,5.7 24.9,3.3 23.7,3.3 23.7,2.3 JP2.28 | v28.3,9.1 28.5,9.1 28.5,16.9 28.4,17 28.4,21.1 27.7,21.8 27.7,24.6 v30.6,27.5 | DSP.26 v37.4,36.6
  Bottom 0.31: v25,5.7 25,6 27.2,6.8 28.3,7.9 v28.3,9.1 | v30.6,27.5 33,29.7 34.8,31.5 36.1,31.5 36.3,31.7 36.3,34 36.6,34.3 37.4,34.3 v37.4,36.6
MLCKI
  Top 0.3: DSP.32 34.4,38.55 C9.2 32.08,38.63 26.47,38.63 Q1.1
N$4
  Top 0.3: R2.1 65.64,47.56 65.3,48.4 LED1.A
N$5  (via drill 0.3)
  Top 0.3: 43.3,44.55 43.18,44.43 T1.C 44.1,40.71 44.1,34.7 | DSP.24 42.9,33.7 44.1,34.7 | DSP.13 40.2,28.2 40.2,27.4 v42.8,27.4 | v44.9,33.7 44.1,34.7
  Top 0.31: C41.1 43.3,44.55 C40.1
  Bottom 0.3: v42.8,27.4 42.8,30.5 v44.9,33.7
N$7
  Top 0.3: DSP.31 34.9,39.35 R8.1
N$8  (via drill 0.3)
  Top 0.3: T1.B 40.9,42.3 40,42.3 39.8,42.1 39.8,41.3 39.55,41.05 R16.1 38.4,40.95 38.4,39.7 39.3,38.8 43.3,38.8 v43.3,35.5 | DSP.17 41.3,30.2 v42.1,30.05
  Bottom 0.3: v42.1,30.05 42.1,30.7 43.3,32.2 v43.3,35.5
N$13
  Top 0.3: 30,42.9 29.99,43.71 29.89,43.81 Q1.2
  Top 0.5: R8.2 34.2,43 30.5,43 30,42.9 C8.2
N$18
  Top 0.3: C46.2 22,40.05 R17.2
N$23
  Top 0.31: DAC1.5 62.88,37.73 C17.1
N$24
  Top 0.31: DAC1.4 65.34,37.09 C23.2
N$27  (via drill 0.3)
  Top 0.3: DSP.3 v33.4,23.3 | v31.4,23.3 30.9,23.3 R18.1
  Bottom 0.3: v33.4,23.3 v31.4,23.3
N$32
  Top 0.3: C36.2 R10.1
N$38
  Top 0.31: C18.1 51.75,39.05 54.34,36.46 DAC1.18
N$40
  Top 0.3: C38.2 R11.1
N$41
  Top 0.31: DAC1.2 65.23,35.82 C23.1
N$44
  Top 0.3: R13.1 C34.1 31.15,13.85 L2.2 31.85,11.85 C38.1
N$45
  Top 0.3: C35.1 R12.1 37.7,15.85 L1.2 38.5,13.2 40,11.7 41.05,11.7 C36.1
N$75
  Top 0.31: R31.2 C84.2
N$76
  Top 0.31: R35.2 C86.2
N$77
  Top 0.31: C88.2 R39.2
N$78
  Top 0.31: C90.2 R44.2
PLL_LF
  Top 0.3: DSP.35 32.9,36.7 22.75,36.7 C46.1 C45.2
RPI_3V3  (1 unrouted)
RPI_BCK
  Top 0.3: JP1.12 21.1,53.7 22.3,52.5 24.9,52.5 24.9,55.3 44.9,55.3 45.2,55 45.2,48.1 53.7,39.6 55,39.6 DAC1.13
RPI_GPIO17  (via drill 0.3)
  Top 0.31: v7.8,35.3 6.85,35.3 R3.1
  Bottom 0.31: JP1.11 21.07,51.53 20.2,52.4 10.1,52.4 9.7,52 9.7,50.4 8.8,49.5 7.2,49.5 3.5,45.8 3.5,35.8 4.1,35.2 7.7,35.2 v7.8,35.3
RPI_GPIO22
  Top 0.3: R7.1 36.3,47.8 34.9,49.4 28.18,49.4 JP1.15
RPI_GPIO27
  Top 0.3: R6.1 34.2,48.8 26.04,48.8 JP1.13
RPI_LRCK
  Top 0.3: DAC1.15 55.1,38.4 56.5,38.4 58.4,40.3 58.4,44.6 58.5,44.7 58.4,44.8 58.4,53.9 57.1,55.2 52.9,55.2 52.9,52.3 51.6,52.3 51.6,51.3 JP1.35
RPI_SDATA
  Top 0.3: JP1.40 57.9,52.5 57.9,40.5 56.4,39 55.1,39 DAC1.14
SCL  (via drill 0.3)
  Top 0.3: JP2.4 53.77,2.23 52.7,3.3 52.7,24.9 44.4,33.2 DSP.23
  Top 0.31: v16.3,48.2 13.5,51.2 JP1.5 | v19.8,45.1 23,45.1 23.5,45.4 24.6,45.4 25.3,46.1 29.3,46.1 29.5,46.3 30.5,46.3 33.2,43.6 34.6,43.6 35.4,42.8 35.4,41.1 v35.3,40.5 | v37.9,38.2 39,37.1 39.1,37.1 39.6,36.6 39.6,35.2 38.8,34.4 38.5,34.4 38.1,34 38.1,33.6 38.5,33.2 DSP.23
  Bottom 0.31: v19.8,45.1 19.3,45.6 v16.3,48.2 | v37.9,38.2 35.3,38.2 v35.3,40.5
SDA  (via drill 0.3)
  Top 0.3: JP2.6 51.47,2.23 50.2,3.5 50.2,5.5 51.8,7.1 51.8,24.4 43.8,32.7 DSP.22
  Top 0.31: v12.3,47.6 12.3,49.9 11,51.2 JP1.3 | DSP.22 36.8,32.7 36.4,32.3 v35.2,32.3
  Top 0.406: v31.6,35.3 v19.1,35.3
  Bottom 0.31: v12.3,47.6 15.6,42.8 15.6,38.8 v19.1,35.3 | v31.6,35.3 32.4,35.3 v35.2,32.3

### Text on the board
tNames: BCK | +5V | DATA | SCL | GND | GND | SDA | LRCK | + | MyDSPi - 2.0 / Vincent Delhalle / October 2016 | +5V | GND